# Altium project WiFi-GPRS_Combo.PrjPcb
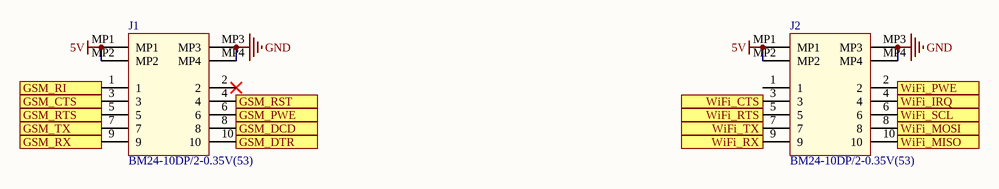
[diagram p0: Expansition.SchDoc]
4 sheets, 53 parts. Net scope: flat (ports and power ports of the same name join across sheets).
Board file: WiFi-GPRS_Combo.PcbDoc
Sheets:
  Expansition.SchDoc
  GPRS.SchDoc
  LTE.SchDoc
  SimCard.SchDoc

## Sheet Expansition.SchDoc: Expansion/Connectors
size A4; DrawnBy: Muhammet YILDIZ; Organization: YılDıZ IoT; Revision: 1.1; SheetNumber: 3; SheetTotal: 7; SheetSize: A4

### Parts
J1  BM24-10DP/2-0.35V(53)  [HIROSE BM2410DP]
J2  BM24-10DP/2-0.35V(53)  [HIROSE BM2410DP]

### Ports
GSM_CTS (in), GSM_DCD (in), GSM_DTR (out), GSM_PWE (out), GSM_RI (in), GSM_RST (out), GSM_RTS (out), GSM_RX (in), GSM_TX (out), WiFi_CTS (in), WiFi_IRQ (in), WiFi_MISO (in), WiFi_MOSI (out), WiFi_PWE (out), WiFi_RTS (out), WiFi_RX (in), WiFi_SCL (out), WiFi_TX (out)

### Nets
5V: J1.MP1 J1.MP2 J2.MP1 J2.MP2
GND: J1.MP3 J1.MP4 J2.MP3 J2.MP4
CTS: J1.3 ; port GSM_CTS
DCD: J1.8 ; port GSM_DCD
DTR: J1.10 ; port GSM_DTR
POWERKEY: J1.4 ; port GSM_RST
RING: J1.1 ; port GSM_RI
RTS: J1.5 ; port GSM_RTS
RXD: J1.7 ; port GSM_TX
TXD: J1.9 ; port GSM_RX
NetJ1_6: J1.6 ; port GSM_PWE
NetJ2_2: J2.2 ; port WiFi_PWE
NetJ2_3: J2.3 ; port WiFi_CTS
NetJ2_4: J2.4 ; port WiFi_IRQ
NetJ2_5: J2.5 ; port WiFi_RTS
NetJ2_6: J2.6 ; port WiFi_SCL
NetJ2_7: J2.7 ; port WiFi_TX
NetJ2_8: J2.8 ; port WiFi_MOSI
NetJ2_9: J2.9 ; port WiFi_RX
NetJ2_10: J2.10 ; port WiFi_MISO

Not connected (* = marked no-connect by the designer): J1 2*; J2 1

### Notes on the sheet
- Title:
- Size:
- Project:
- Revision:
- Sheet
- of
- Date:
- YıLDıZ IoT
- Elperek Mahallesi
- Saray Sokak, No:12
- SAKARYA / TURKEY
- File:

### Library data of the parts
J1 J2 = 12 Pin (10 + 2 Power) B2B Header: Board to Board Connector; Manufacturer: Hirose; Pitch: 0.014inch; Mated Stacking Heights: 0.8mm; Supplier 1: Digi-Key; Supplier Part Number 1: H124923CT-ND; Manufacturer Part Number: BM24-10DP/2-0.35V(53); Stock 1: 2583; Pricing 1: 1 = 1,08000, 10 = 0,95400, 25 = 0,89760, 50 = 0,86020, 100 = 0,82280, 250 = 0,74800, 500 = 0,67320 (USD); RoHS: Yes; Mount: Surface Mount; Number of Pins: 10; Contact Plating: Gold; Packaging: Tape and Reel; Number of Rows: 2; ComponentLink1URL: https://media.digikey.com/pdf/Data%20Sheets/Hirose%20PDFs/BM24.pdf?src-supplier=Digi-Key; ComponentLink1Description: https://media.digikey.com/pdf/Data%20Sheets/Hirose%20PDFs/BM24.pdf?src-supplier=Digi-Key; ComponentLink2URL: https://www.hirose.com/product/en/download_file/key_name/BM24-10DP__2-0.35V%2853%29/category/Specification%20Sheet/doc_file_id/87039/?file_category_id=9&item_id=06772001953&is_series=&src-supplier=Digi-Key; ComponentLink2Description: https://www.hirose.com/product/en/download_file/key_name/BM24-10DP__2-0.35V%2853%29/category/Specification%20Sheet/doc_file_id/87039/?file_category_id=9&item_id=06772001953&is_series=&src-supplier=Digi-Key

## Sheet GPRS.SchDoc: GPRS
size A4; DrawnBy: Muhammet YILDIZ; Organization: YıLDıZ IoT; Revision: 1.1; SheetNumber: 4; SheetTotal: 7; SheetSize: A4
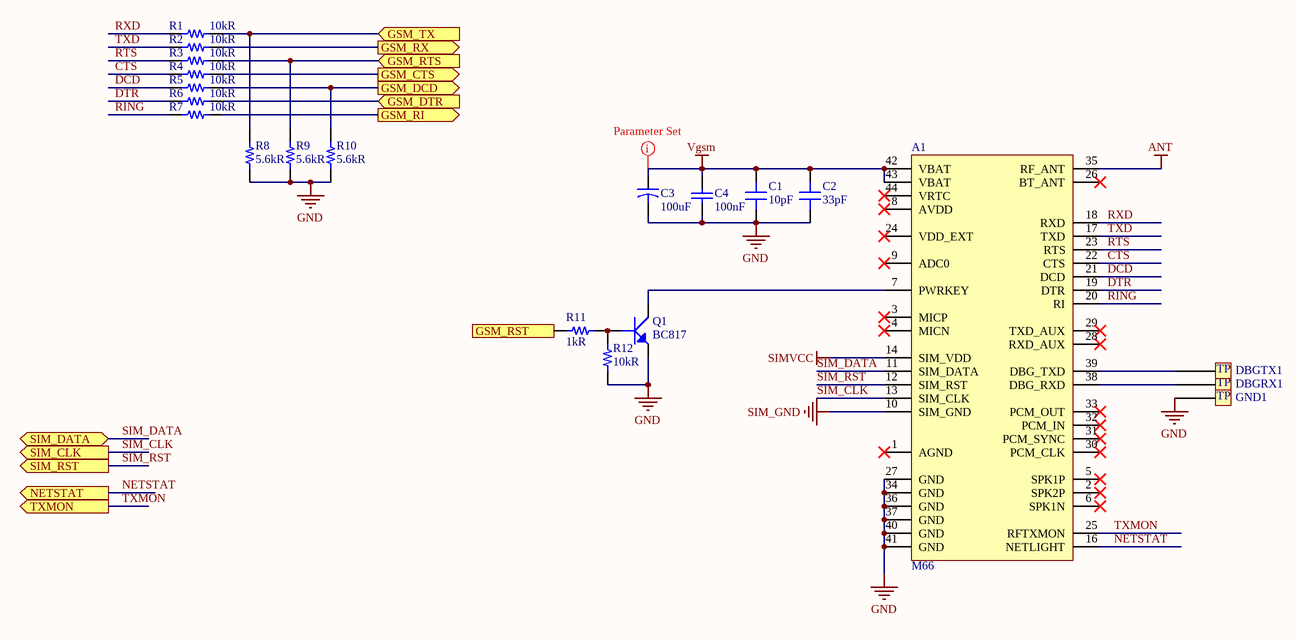
[diagram p1: GPRS.SchDoc]

### Parts
A1  M66  [QUECTEL - M66]
C1  10pF  [CAP 0603/1608]
C2  33pF  [CAP 0603/1608]
C3  100uF  [CAP POL 2012X150USR]
C4  100nF  [CAP 0603/1608]
DBGRX1  Test Point  [TestPoint]  (value not drawn)  (no BOM)
DBGTX1  Test Point  [TestPoint]  (value not drawn)  (no BOM)
GND1  Test Point  [TestPoint]  (value not drawn)  (no BOM)
Q1  BC817  [SOT23-3]
R1  10kR  [RES 0603/1608]
R2  10kR  [RES 0603/1608]
R3  10kR  [RES 0603/1608]
R4  10kR  [RES 0603/1608]
R5  10kR  [RES 0603/1608]
R6  10kR  [RES 0603/1608]
R7  10kR  [RES 0603/1608]
R8  5.6kR  [RES 0603/1608]
R9  5.6kR  [RES 0603/1608]
R10  5.6kR  [RES 0603/1608]
R11  1kR  [RES 0603/1608]
R12  10kR  [RES 0603/1608]

### Ports
GSM_CTS (out), GSM_DCD (out), GSM_DTR (in), GSM_RI (out), GSM_RST (in), GSM_RTS (in), GSM_RX (out), GSM_TX (in), NETSTAT (out), SIM_CLK (out), SIM_DATA (bidir), SIM_RST (out), TXMON (out)

### Nets
ANT: A1.35(RF_ANT)
GND: A1.27(GND) A1.34(GND) A1.36(GND) A1.37(GND) A1.40(GND) A1.41(GND) C1.1 C2.1 C3.1 C4.1 GND1.1 Q1.2(E) R8.1 R9.1 R10.1 R12.1
SIM_GND: A1.10(SIM_GND)
SIMVCC: A1.14(SIM_VDD)
Vgsm: A1.42(VBAT) A1.43(VBAT) C1.2 C2.2 C3.2 C4.2
CTS: R4.1 ; port GSM_CTS
CTS: A1.22(CTS) R4.2  [a separate net that carries the same name]
DCD: R5.1 R10.2 ; port GSM_DCD
DCD: A1.21(DCD) R5.2  [a separate net that carries the same name]
DTR: R6.1 ; port GSM_DTR
DTR: A1.19(DTR) R6.2  [a separate net that carries the same name]
NETSTAT: A1.16(NETLIGHT) ; port NETSTAT
POWERKEY: R11.2 ; port GSM_RST
RING: R7.1 ; port GSM_RI
RING: A1.20(RI) R7.2  [a separate net that carries the same name]
RTS: R3.1 R9.2 ; port GSM_RTS
RTS: A1.23(RTS) R3.2  [a separate net that carries the same name]
RXD: R1.1 R8.2 ; port GSM_TX
RXD: A1.18(RXD) R1.2  [a separate net that carries the same name]
SIM_CLK: A1.13(SIM_CLK) ; port SIM_CLK
SIM_DATA: A1.11(SIM_DATA) ; port SIM_DATA
SIM_RST: A1.12(SIM_RST) ; port SIM_RST
TXD: R2.1 ; port GSM_RX
TXD: A1.17(TXD) R2.2  [a separate net that carries the same name]
TXMON: A1.25(RFTXMON) ; port TXMON
NetA1_7: A1.7(PWRKEY) Q1.3(C)
NetA1_38: A1.38(DBG_RXD) DBGRX1.1
NetA1_39: A1.39(DBG_TXD) DBGTX1.1
NetQ1_1: Q1.1(B) R11.1 R12.2

Not connected (* = marked no-connect by the designer): A1 1(AGND)* 2(SPK2P)* 3(MICP)* 4(MICN)* 5(SPK1P)* 6(SPK1N)* 8(AVDD)* 9(ADC0)* 15(NC) 24(VDD_EXT)* 26(BT_ANT)* 28(RXD_AUX)* 29(TXD_AUX)* 30(PCM_CLK)* 31(PCM_SYNC)* 32(PCM_IN)* 33(PCM_OUT)* 44(VRTC)*

### Layout directives
rule Width Constraint [Pref Width = 0.5mm    Min Width = 0.5mm    Max Width = 3mm]; net class Vgsm: Vgsm

### Notes on the sheet
- Title:
- Size:
- Project:
- Revision:
- Sheet
- of
- Date:
- YıLDıZ IoT
- Elperek Mahallesi
- Saray Sokak, No:12
- SAKARYA / TURKEY
- File:
- (in symbol Test Point) TP

### Library data of the parts
A1 = Qectel M66: GSM/GPRS Module Series; Manufacturer: QUECTEL; RF Family/Standard: Cellular, Navigation; Protocol: 2G GPRS, GSM; Frequency: 824MHz ~ 960MHz, 1.71GHz ~ 1.99GHz; Data Rate: 85.6kbps; Power - Output: 32.2dBm; Sensitivity: -109dBm; Serial Interfaces: UART; Antenna Type: Antenna Not Included; Voltage - Supply: 3.8V; Current - Receiving: 350mA; Manufacturer Part Number: M66; Supplier 1: empa; Supplier Part Number 1: M66DSFA-04-STD; Stock 1: 1144; Pricing 1: 1 = 6,27 (USD); RoHS: No; Case/Package: Module; ComponentLink1URL: https://www.u-blox.com/sites/default/files/SARA-G3_DataSheet_%28UBX-13000993%29.pdf?src-supplier=Digi-Key; ComponentLink1Description: https://www.u-blox.com/sites/default/files/SARA-G3_DataSheet_%28UBX-13000993%29.pdf?src-supplier=Digi-Key; Current - Transmitting: 350mA; Operating Temperature: 40°C ~ 85°C
C1 = Capacitor - Ceramic: Ceramic, SMT Capacitor; Manufacturer: Yageo; Manufacturer Part Number: CC0603JRNPO9BN100; Tolerance: 5%; Voltage Rating: 50V; Dielectric: C0G; Temperature Coefficient: 30ppm/°C; Insulation Resistance: 100GR; Supplier 1: Digi-Key; Supplier Part Number 1: 311-1058-1-ND; Stock 1: 128799; Pricing 1: 1 = 0,10000, 10 = 0,06100, 100 = 0,02730, 500 = 0,01948, 1000 = 0,01530 (USD); RoHS: Yes; Mount: Surface Mount; Case/Package: 0603; Number of Pins: 2; Case Code (Metric): 1608; Case Code (Imperial): 0603; Min Operating Temperature: -55°C; Max Operating Temperature: 125°C; Capacitance: 10pF; Voltage Rating (DC): 50V; Packaging: Tape and Reel; Package Quantity: 1; Termination: SMD/SMT; Composition: Ceramic; Voltage: 50V; Length: 1.6mm; Height: 0.8mm; Width: 0.031inch; Thickness: 0.035inch; Depth: 0.8mm; Radiation Hardening: No; REACH SVHC: No SVHC; Lead Free: Lead Free; ComponentLink1URL: http://www.farnell.com/datasheets/2213336.pdf?src-supplier=Farnell; ComponentLink1Description: http://www.farnell.com/datasheets/2213336.pdf?src-supplier=Farnell; ComponentLink2URL: https://www.verical.com/server-webapp/html/getDatasheet?partID=403524&src-supplier=Verical; ComponentLink2Description: https://www.verical.com/server-webapp/html/getDatasheet?partID=403524&src-supplier=Verical; ComponentLink3URL: http://www.farnell.com/datasheets/1835847.pdf?src-supplier=Element14; ComponentLink3Description: http://www.farnell.com/datasheets/1835847.pdf?src-supplier=Element14; ComponentLink4URL: http://www.yageo.com/documents/recent/UPY-GP_NP0_16V-to-50V_16.pdf?src-supplier=Digi-Key; ComponentLink4Description: http://www.yageo.com/documents/recent/UPY-GP_NP0_16V-to-50V_16.pdf?src-supplier=Digi-Key; ComponentLink5URL: http://www.farnell.com/datasheets/1734582.pdf?src-supplier=Element14; ComponentLink5Description: http://www.farnell.com/datasheets/1734582.pdf?src-supplier=Element14; ComponentLink6URL: http://www.yageo.com/documents/recent/UPY-GP_NP0_16V-to-50V_8.pdf?src-supplier=Avnet+Europe; ComponentLink6Description: http://www.yageo.com/documents/recent/UPY-GP_NP0_16V-to-50V_8.pdf?src-supplier=Avnet+Europe; ComponentLink7URL: http://www.mouser.com/ds/2/447/Yageo_UPY-GP_NP0_16V-to-50V_9-358835.pdf?src-supplier=Mouser; ComponentLink7Description: http://www.mouser.com/ds/2/447/Yageo_UPY-GP_NP0_16V-to-50V_9-358835.pdf?src-supplier=Mouser; ComponentLink8URL: http://www.farnell.com/datasheets/1132289.pdf?src-supplier=Element14; ComponentLink8Description: http://www.farnell.com/datasheets/1132289.pdf?src-supplier=Element14
C2 = Capacitor - Ceramic: Ceramic, SMT Capacitor; Manufacturer: Walsin Technologies; Manufacturer Part Number: 0603N330J500CT; Tolerance: 5%; Dielectric: C0G; Voltage Rating: 50V; Supplier 1: Digi-Key; Supplier Part Number 1: 1292-1645-1-ND; Stock 1: 411190; Pricing 1: 1 = 0,10000, 10 = 0,03300, 100 = 0,01490, 500 = 0,01062, 1000 = 0,00835 (USD); RoHS: Yes; Case/Package: Ceramic; Case Code (Metric): 1608; Case Code (Imperial): 0603; Min Operating Temperature: -55°C; Max Operating Temperature: 125°C; Capacitance: 33pF; Packaging: Tape and Reel; Voltage Rating (DC): 50V; Length: 1.6mm; Depth: 0.8mm; Radiation Hardening: No; REACH SVHC: Unknown; Lead Free: Lead Free; ComponentLink1URL: https://www.verical.com/server-webapp/html/getDatasheet?partID=572322&src-supplier=Verical; ComponentLink1Description: https://www.verical.com/server-webapp/html/getDatasheet?partID=572322&src-supplier=Verical
C3 = Capacitor - Tantalum: Capacitor, Tantalum; Manufacturer: Kyocera AVX; Manufacturer Part Number: TPSB107M006R0250; ESR (Equivalent Series Resistance): 250mR; Voltage Rating: 6.3V; Tolerance: 20%; Polarity: Polar; Dissipation Factor: 10%; Supplier 1: Digi-Key; Supplier Part Number 1: 478-4978-1-ND; Stock 1: 22431; Pricing 1: 1 = 0,65000, 10 = 0,47900, 100 = 0,32840, 500 = 0,25996, 1000 = 0,21891 (USD); RoHS: Yes; Mount: Surface Mount; Case/Package: 1210; Number of Pins: 2; Case Code (Imperial): 1210; Case Code (Metric): 3528; Dielectric Material: Tantalum; Min Operating Temperature: -55°C; Max Operating Temperature: 125°C; Capacitance: 100uF; Package Quantity: 1; Packaging: Tape and Reel; Termination: SMD/SMT; Voltage Rating (DC): 6.3V; Features: General Purpose; Length: 3.5mm; Height: 2.1mm; Width: 2.8mm; Height - Seated (Max): 0.083inch; Depth: 2.8mm; Radiation Hardening: No; Lead Free: Lead Free; ComponentLink1URL: http://datasheets.avx.com/TPS.pdf?src-supplier=Digi-Key; ComponentLink1Description: http://datasheets.avx.com/TPS.pdf?src-supplier=Digi-Key; ComponentLink2URL: http://www.avx.com/docs/catalogs/tps.pdf?src-supplier=Avnet; ComponentLink2Description: http://www.avx.com/docs/catalogs/tps.pdf?src-supplier=Avnet; ComponentLink3URL: http://www.avxcorp.com/docs/Catalogs/tps.pdf?src-supplier=Future+Electronics; ComponentLink3Description: http://www.avxcorp.com/docs/Catalogs/tps.pdf?src-supplier=Future+Electronics; ComponentLink4URL: http://www.avx.com/docs/catalogs/tps.pdf?src-supplier=Avnet+Europe; ComponentLink4Description: http://www.avx.com/docs/catalogs/tps.pdf?src-supplier=Avnet+Europe
C4 = Cap - Ceramic: Capacitor, Ceramic; Manufacturer: Samsung; Manufacturer Part Number: CL10A104KA8NNNC; Tolerance: 10%; Voltage Rating: 25V; Dielectric: X5R; Supplier 1: Digi-Key; Supplier Part Number 1: 1276-1857-1-ND; Stock 1: 978306; Pricing 1: 1 = 0,10000, 10 = 0,04600, 100 = 0,02070, 500 = 0,01478, 1000 = 0,01162 (USD); RoHS: Yes; Mount: Surface Mount; Case/Package: 0603; Case Code (Metric): 1608; Case Code (Imperial): 0603; Contact Plating: Tin; Min Operating Temperature: -55°C; Max Operating Temperature: 85°C; Package Quantity: 1; Packaging: Tape and Reel; Capacitance: 100nF; Voltage Rating (DC): 25V; Termination: Wraparound; Length: 0.063inch; Width: 0.031inch; Thickness: 0.035inch; Lead Free: Lead Free; ComponentLink1URL: http://www.samsungsem.com/kr/support/library/product-catalog/mlcc.jsp; ComponentLink1Description: http://www.samsungsem.com/kr/support/library/product-catalog/mlcc.jsp; Price: 0,1
DBGRX1 DBGTX1 GND1 = Test Point: Custom Test Point
Q1 = BC817: Transistor, BC817; Manufacturer: ON Semiconductor; Manufacturer Part Number: BC817-16LT1G; Transistor Type: NPN; Vce Saturation (Max) @ Ib, Ic: 700mV @ 50mA, 500mA; Current - Collector Cutoff (Max): 100nA (ICBO); DC Current Gain (hFE) (Min) @ Ic, Vce: 100 @ 100mA, 1V; Frequency - Transition: 100MHz; Supplier 1: Digi-Key; Supplier Part Number 1: BC817-16LT1GOSCT-ND; RoHS: RoHS Compliant; Category: Discrete Semiconductor Products; Stock 1: 46603; Pricing 1: 1=0.13, 10=0.118, 100=0.0642, 500=0.0395, 1000=0.02693 (USD); Packaging: Cut Tape (CT); Part Status: Active; Operating Temperature: -65°C ~ 150°C (TJ); Mounting Type: Surface Mount; Package / Case: TO-236-3, SC-59, SOT-23-3; Supplier Device Package: SOT-23-3 (TO-236); Base Part Number: BC817; ComponentLink1URL: http://www.onsemi.com/pub/Collateral/BC817-16LT1-D.PDF; ComponentLink1Description: http://www.onsemi.com/pub/Collateral/BC817-16LT1-D.PDF; Price: 0,13
R1-R7 R12 = Resistor_Chip: Ceramic, SMT Capacitor; Manufacturer: Stackpole Electronics; Manufacturer Part Number: RNCP0603FTD10K0; Tolerance: 1%; Max Power Dissipation: 125mW; Temperature Coefficient: 100ppm/°C; Supplier 1: Digi-Key; Supplier Part Number 1: RNCP0603FTD10K0CT-ND; Stock 1: 183083; Pricing 1: 1 = 0,10000, 10 = 0,06700, 100 = 0,02730, 1000 = 0,01224, 2500 = 0,01063 (USD); RoHS: Yes; Mount: Surface Mount; Case/Package: 0603; Case Code (Metric): 1608; Case Code (Imperial): 0603; Contact Plating: Matte,Tin; Min Operating Temperature: -55°C; Max Operating Temperature: 155°C; Packaging: Tape and Reel; Resistance: 10kR; Composition: Thin Film; Number of Terminations: 2; Features: Anti-Sulfur,Moisture Resistant; Length: 0.059inch; Height: 0.02inch; Width: 0.031inch; Radiation Hardening: No; Lead Free: Lead Free
R8-R10 = Resistor_Chip: Ceramic, SMT Capacitor; Manufacturer: TE Connectivity; Manufacturer Part Number: CRGCQ0603F5K6; Tolerance: 1%; Max Power Dissipation: 100mW; Temperature Coefficient: 100ppm/°C; Supplier 1: Digi-Key; Supplier Part Number 1: A129697CT-ND; Stock 1: 37798; Pricing 1: 1 = 0,10000, 10 = 0,03000, 100 = 0,01200, 1000 = 0,00541, 2500 = 0,00469 (USD); RoHS: No; Case/Package: 0603; Case Code (Imperial): 0603; Case Code (Metric): 1608; Min Operating Temperature: -55°C; Max Operating Temperature: 155°C; Composition: Thick Film; Features: Moisture Resistant,Automotive AEC-Q200; Packaging: Cut Tape; Resistance: 5.6kR; Number of Terminations: 2; ComponentLink1URL: http://www.farnell.com/datasheets/2609223.pdf?src-supplier=Farnell; ComponentLink1Description: http://www.farnell.com/datasheets/2609223.pdf?src-supplier=Farnell; ComponentLink2URL: https://www.te.com/commerce/DocumentDelivery/DDEController?Action=srchrtrv&amp;DocNm=1773204-3&amp;DocType=DS&amp;DocLang=English&src-supplier=Digi-Key; ComponentLink2Description: https://www.te.com/commerce/DocumentDelivery/DDEController?Action=srchrtrv&amp;DocNm=1773204-3&amp;DocType=DS&amp;DocLang=English&src-supplier=Digi-Key; ComponentLink3URL: https://www.te.com/commerce/DocumentDelivery/DDEController?Action=srchrtrv&DocNm=1773204-3&DocType=DS&DocLang=English&src-supplier=Digi-Key; ComponentLink3Description: https://www.te.com/commerce/DocumentDelivery/DDEController?Action=srchrtrv&DocNm=1773204-3&DocType=DS&DocLang=English&src-supplier=Digi-Key
R11 = Resistor_Chip: Ceramic, SMT Capacitor; Manufacturer: Rohm; Manufacturer Part Number: ESR03EZPJ102; Tolerance: 5%; Temperature Coefficient: 200ppm/°C; Max Power Dissipation: 250mW; Supplier 1: Digi-Key; Supplier Part Number 1: RHM1.0KDCT-ND; Stock 1: 148117; Pricing 1: 1 = 0,10000, 10 = 0,08300, 100 = 0,03180, 1000 = 0,01398, 2500 = 0,01207 (USD); RoHS: Yes; Case/Package: 0603; Case Code (Metric): 1608; Case Code (Imperial): 0603; Min Operating Temperature: -55°C; Max Operating Temperature: 155°C; Resistance: 1kR; Package Quantity: 1; Packaging: Tape and Reel; Composition: Thick Film; Number of Terminations: 2; Features: Automotive AEC-Q200; Length: 0.063inch; Height: 0.022inch; Width: 0.031inch; Lead Free: Lead Free; ComponentLink1URL: https://datasheet.ciiva.com/2469/esr-2469603.pdf?src-supplier=Digi-Key; ComponentLink1Description: https://datasheet.ciiva.com/2469/esr-2469603.pdf?src-supplier=Digi-Key; ComponentLink2URL: https://datasheet.ciiva.com/2469/esr-2469604.pdf?src-supplier=Digi-Key; ComponentLink2Description: https://datasheet.ciiva.com/2469/esr-2469604.pdf?src-supplier=Digi-Key; ComponentLink3URL: https://datasheet.ciiva.com/2469/esr-2469605.pdf?src-supplier=Digi-Key; ComponentLink3Description: https://datasheet.ciiva.com/2469/esr-2469605.pdf?src-supplier=Digi-Key

## Sheet LTE.SchDoc: LTE
size A4; DrawnBy: Muhammet YILDIZ; Organization: YıLDıZ IoT; Revision: 1.1; SheetNumber: 6; SheetTotal: 7; SheetSize: A4
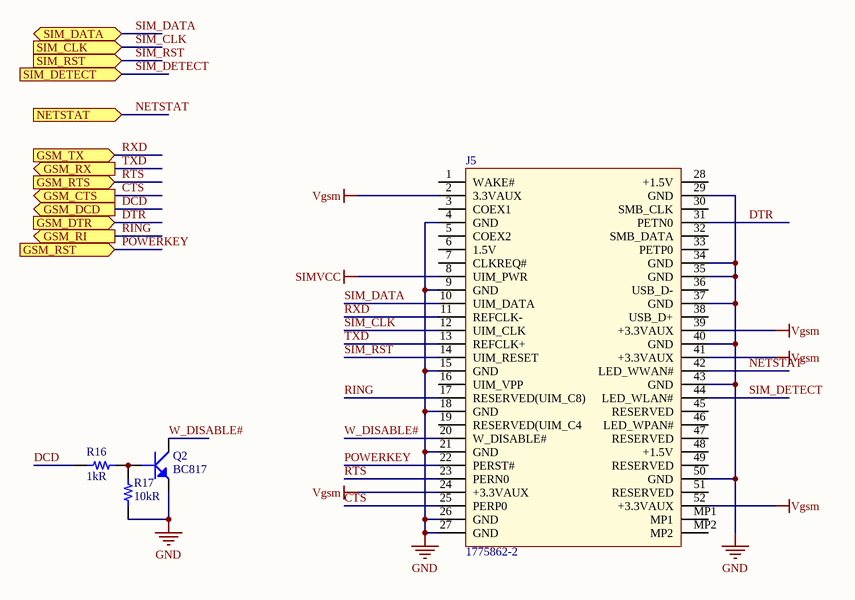
[diagram p2: LTE.SchDoc]

### Parts
J5  1775862-2  [TE 1775862-2]
Q2  BC817  [SOT23-3]
R16  1kR  [RES 0603/1608]
R17  10kR  [RES 0603/1608]

### Ports
GSM_CTS (out), GSM_DCD (out), GSM_DTR (in), GSM_RI (out), GSM_RST (in), GSM_RTS (in), GSM_RX (out), GSM_TX (in), NETSTAT (in), SIM_CLK (in), SIM_DATA (bidir), SIM_DETECT (in), SIM_RST (in)

### Nets
GND: J5.4(GND) J5.9(GND) J5.15(GND) J5.18(GND) J5.21(GND) J5.26(GND) J5.27(GND) J5.29(GND) J5.34(GND) J5.35(GND) J5.37(GND) J5.40(GND) J5.43(GND) J5.50(GND) Q2.2(E) R17.1
SIMVCC: J5.8(UIM_PWR)
Vgsm: J5.2(3.3VAUX) J5.24(+3.3VAUX) J5.39(+3.3VAUX) J5.41(+3.3VAUX) J5.52(+3.3VAUX)
CTS: J5.25(PERP0) ; port GSM_CTS
DCD: R16.2 ; port GSM_DCD
DTR: J5.31(PETN0) ; port GSM_DTR
NETSTAT: J5.42(LED_WWAN#) ; port NETSTAT
POWERKEY: J5.22(PERST#) ; port GSM_RST
RING: J5.17(RESERVED(UIM_C8)) ; port GSM_RI
RTS: J5.23(PERN0) ; port GSM_RTS
RXD: J5.11(REFCLK-) ; port GSM_TX
SIM_CLK: J5.12(UIM_CLK) ; port SIM_CLK
SIM_DATA: J5.10(UIM_DATA) ; port SIM_DATA
SIM_DETECT: J5.44(LED_WLAN#) ; port SIM_DETECT
SIM_RST: J5.14(UIM_RESET) ; port SIM_RST
TXD: J5.13(REFCLK+) ; port GSM_RX
W_DISABLE#: J5.20(W_DISABLE#) Q2.3(C)
NetQ2_1: Q2.1(B) R16.1 R17.2

Not connected (* = marked no-connect by the designer): J5 1(WAKE#) 3(COEX1) 5(COEX2) 6(1.5V) 7(CLKREQ#) 16(UIM_VPP) 19(RESERVED(UIM_C4) 28(+1.5V) 30(SMB_CLK) 32(SMB_DATA) 33(PETP0) 36(USB_D-) 38(USB_D+) 45(RESERVED) 46(LED_WPAN#) 47(RESERVED) 48(+1.5V) 49(RESERVED) 51(RESERVED) MP1 MP2

### Notes on the sheet
- Title:
- Size:
- Project:
- Revision:
- Sheet
- of
- Date:
- YıLDıZ IoT
- Elperek Mahallesi
- Saray Sokak, No:12
- SAKARYA / TURKEY
- File:

### Library data of the parts
J5 = Mini PCIe: Manufacturer: TE Connectivity; Number of Contacts: 52; Connector Type: Receptacle; High Temperature Housing: Yes; PCB Mount Retention: Without; PCB Mounting Orientation: Horizontal; Stackable: No; Pitch: 0.8mm; Row Spacing: 0.031inch; Stack Height: 5.2mm; Supplier 1: Digi-Key; Supplier Part Number 1: A142273CT-ND; Manufacturer Part Number: 1775862-2; Stock 1: 11289; Pricing 1: 1 = 0,77000, 10 = 0,72000, 25 = 0,64840, 50 = 0,57620, 100 = 0,55230, 250 = 0,50424 (USD); RoHS: Yes; Mount: Surface Mount; Contact Plating: Gold; Contact Material: Copper Alloy; Housing Material: Thermoplastic; Housing Color: Black; Termination: Solder; Number of Rows: 2; Packaging: Tape and Reel; Orientation: Right Angle; Number of Positions: 52; Package Quantity: 550; Radiation Hardening: No; Flammability Rating: UL94 V-0; Lead Free: Contains Lead; ELV: Compliant; ComponentLink1URL: http://www.farnell.com/datasheets/2645681.pdf?src-supplier=Farnell; ComponentLink1Description: http://www.farnell.com/datasheets/2645681.pdf?src-supplier=Farnell; ComponentLink2URL: http://components.arrow.com/part/dataview/0323_06583025?src-supplier=Arrow+Europe; ComponentLink2Description: http://components.arrow.com/part/dataview/0323_06583025?src-supplier=Arrow+Europe; ComponentLink3URL: http://www.onlinecomponents.com/datasheet/17758622.aspx?p=10266609&src-supplier=Onlinecomponents.com; ComponentLink3Description: http://www.onlinecomponents.com/datasheet/17758622.aspx?p=10266609&src-supplier=Onlinecomponents.com; ComponentLink4URL: http://components.arrow.com/part/dataview/47764795S8999339N5665?src-supplier=Arrow+Electronics; ComponentLink4Description: http://components.arrow.com/part/dataview/47764795S8999339N5665?src-supplier=Arrow+Electronics; ComponentLink5URL: https://www.te.com/commerce/DocumentDelivery/DDEController?Action=srchrtrv&DocNm=1775862&DocType=Customer+Drawing&DocLang=English&src-supplier=Digi-Key; ComponentLink5Description: https://www.te.com/commerce/DocumentDelivery/DDEController?Action=srchrtrv&DocNm=1775862&DocType=Customer+Drawing&DocLang=English&src-supplier=Digi-Key; ComponentLink6URL: http://www.farnell.com/datasheets/2645681.pdf?src-supplier=Element14; ComponentLink6Description: http://www.farnell.com/datasheets/2645681.pdf?src-supplier=Element14; ComponentLink7URL: https://www.te.com/commerce/DocumentDelivery/DDEController?Action=srchrtrv&amp;DocNm=1775862&amp;DocType=Customer+Drawing&amp;DocLang=English&src-supplier=Digi-Key; ComponentLink7Description: https://www.te.com/commerce/DocumentDelivery/DDEController?Action=srchrtrv&amp;DocNm=1775862&amp;DocType=Customer+Drawing&amp;DocLang=English&src-supplier=Digi-Key; ComponentLink8URL: http://www.farnell.com/datasheets/2645681.pdf?src-supplier=Newark; ComponentLink8Description: http://www.farnell.com/datasheets/2645681.pdf?src-supplier=Newark; ComponentLink9URL: http://www.te.com/commerce/DocumentDelivery/DDEController?Action=showdoc&DocId=Data+Sheet8-1773459-7_EXPRESS_MINI_CARD_QRG1011pdfEnglishENG_DS_8-1773459-7_EXPRESS_MINI_CARD_QRG_1011.pdf&src-supplier=Avnet; ComponentLink9Description: http://www.te.com/commerce/DocumentDelivery/DDEController?Action=showdoc&DocId=Data+Sheet8-1773459-7_EXPRESS_MINI_CARD_QRG1011pdfEnglishENG_DS_8-1773459-7_EXPRESS_MINI_CARD_QRG_1011.pdf&src-supplier=Avnet; ComponentLink10URL: http://www.te.com/commerce/DocumentDelivery/DDEController?Action=showdoc&DocId=Data+Sheet%7F8-1773459-7_EXPRESS_MINI_CARD_QRG%7F1011%7Fpdf%7FEnglish%7FENG_DS_8-1773459-7_EXPRESS_MINI_CARD_QRG_1011.pdf&src-supplier=Avnet+Europe; ComponentLink10Description: http://www.te.com/commerce/DocumentDelivery/DDEController?Action=showdoc&DocId=Data+Sheet%7F8-1773459-7_EXPRESS_MINI_CARD_QRG%7F1011%7Fpdf%7FEnglish%7FENG_DS_8-1773459-7_EXPRESS_MINI_CARD_QRG_1011.pdf&src-supplier=Avnet+Europe; ComponentLink11URL: http://www.te.com/commerce/DocumentDelivery/DDEController?Action=showdoc&DocId=Data+Sheet8-1773459-7_EXPRESS_MINI_CARD_QRG1011pdfEnglishENG_DS_8-1773459-7_EXPRESS_MINI_CARD_QRG_1011.pdf&src-supplier=Avnet+Asia; ComponentLink11Description: http://www.te.com/commerce/DocumentDelivery/DDEController?Action=showdoc&DocId=Data+Sheet8-1773459-7_EXPRESS_MINI_CARD_QRG1011pdfEnglishENG_DS_8-1773459-7_EXPRESS_MINI_CARD_QRG_1011.pdf&src-supplier=Avnet+Asia
Q2 = BC817: as Q1 on sheet GPRS; Supplier 1: Digi-Key; Supplier Part Number 1: BC817-16LT1GOSCT-ND; RoHS: RoHS Compliant; Category: Discrete Semiconductor Products; Stock 1: 46603; Pricing 1: 1=0.13, 10=0.118, 100=0.0642, 500=0.0395, 1000=0.02693 (USD); Packaging: Cut Tape (CT); Part Status: Active; Operating Temperature: -65°C ~ 150°C (TJ); Mounting Type: Surface Mount; Package / Case: TO-236-3, SC-59, SOT-23-3; Supplier Device Package: SOT-23-3 (TO-236); Base Part Number: BC817; ComponentLink1URL: http://www.onsemi.com/pub/Collateral/BC817-16LT1-D.PDF; ComponentLink1Description: http://www.onsemi.com/pub/Collateral/BC817-16LT1-D.PDF; Price: 0,13
R16 = Resistor_Chip: as R11 on sheet GPRS; Supplier 1: Digi-Key; Supplier Part Number 1: RHM1.0KDCT-ND; Stock 1: 148117; Pricing 1: 1 = 0,10000, 10 = 0,08300, 100 = 0,03180, 1000 = 0,01398, 2500 = 0,01207 (USD); RoHS: Yes; Case/Package: 0603; Case Code (Metric): 1608; Case Code (Imperial): 0603; Min Operating Temperature: -55°C; Max Operating Temperature: 155°C; Resistance: 1kR; Package Quantity: 1; Packaging: Tape and Reel; Composition: Thick Film; Number of Terminations: 2; Features: Automotive AEC-Q200; Length: 0.063inch; Height: 0.022inch; Width: 0.031inch; Lead Free: Lead Free; ComponentLink1URL: https://datasheet.ciiva.com/2469/esr-2469603.pdf?src-supplier=Digi-Key; ComponentLink1Description: https://datasheet.ciiva.com/2469/esr-2469603.pdf?src-supplier=Digi-Key; ComponentLink2URL: https://datasheet.ciiva.com/2469/esr-2469604.pdf?src-supplier=Digi-Key; ComponentLink2Description: https://datasheet.ciiva.com/2469/esr-2469604.pdf?src-supplier=Digi-Key; ComponentLink3URL: https://datasheet.ciiva.com/2469/esr-2469605.pdf?src-supplier=Digi-Key; ComponentLink3Description: https://datasheet.ciiva.com/2469/esr-2469605.pdf?src-supplier=Digi-Key
R17 = Resistor_Chip: as R1 on sheet GPRS; Supplier 1: Digi-Key; Supplier Part Number 1: RNCP0603FTD10K0CT-ND; Stock 1: 183083; Pricing 1: 1 = 0,10000, 10 = 0,06700, 100 = 0,02730, 1000 = 0,01224, 2500 = 0,01063 (USD); RoHS: Yes; Mount: Surface Mount; Case/Package: 0603; Case Code (Metric): 1608; Case Code (Imperial): 0603; Contact Plating: Matte,Tin; Min Operating Temperature: -55°C; Max Operating Temperature: 155°C; Packaging: Tape and Reel; Resistance: 10kR; Composition: Thin Film; Number of Terminations: 2; Features: Anti-Sulfur,Moisture Resistant; Length: 0.059inch; Height: 0.02inch; Width: 0.031inch; Radiation Hardening: No; Lead Free: Lead Free

## Sheet SimCard.SchDoc: Sim Card
size A4; DrawnBy: Muhammet YILDIZ; Organization: YıLDıZ IoT; Revision: 1.1; SheetNumber: 7; SheetTotal: 7; SheetSize: A4
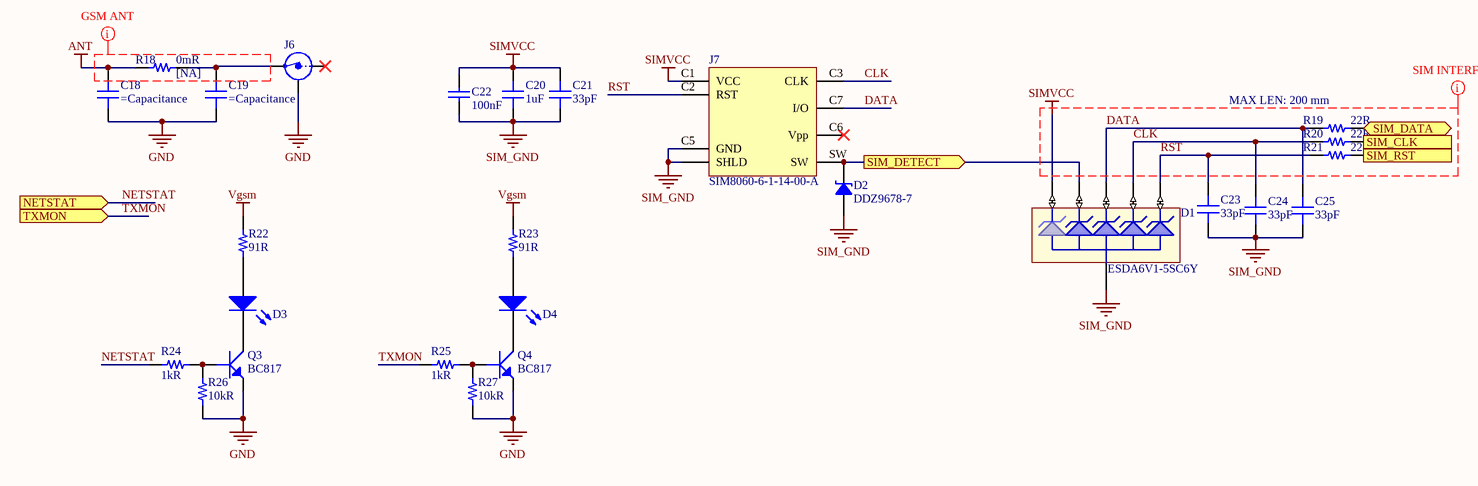
[diagram p3: SimCard.SchDoc]

### Parts
C18  (no value)  [CAP 0603/1608]  (no BOM)
C19  (no value)  [CAP 0603/1608]  (no BOM)
C20  1uF  [CAP 0603/1608]
C21  33pF  [CAP 0603/1608]
C22  100nF  [CAP 0603/1608]
C23  33pF  [CAP 0603/1608]
C24  33pF  [CAP 0603/1608]
C25  33pF  [CAP 0603/1608]
D1  ESDA6V1-5SC6Y  [SOT23-6]
D2  DDZ9678-7  [SOD-123]
D3  150080VS75000  [LED-0805-A]  (value not drawn)  (no BOM)
D4  150080VS75000  [LED-0805-A]  (value not drawn)  (no BOM)
J6  1909763-1  [TE C-1909763]  (value not drawn)
J7  SIM8060-6-1-14-00-A  [GCT SIM8060-6-1-14-00-A]
Q3  BC817  [SOT23-3]  (no BOM)
Q4  BC817  [SOT23-3]  (no BOM)
R18  0mR  [RES 0603/1608]  (no BOM)
R19  22R  [RES 0603/1608]
R20  22R  [RES 0603/1608]
R21  22R  [RES 0603/1608]
R22  91R  [RES 0603/1608]  (no BOM)
R23  91R  [RES 0603/1608]  (no BOM)
R24  1kR  [RES 0603/1608]
R25  1kR  [RES 0603/1608]
R26  10kR  [RES 0603/1608]
R27  10kR  [RES 0603/1608]

### Ports
NETSTAT (in), SIM_CLK (in), SIM_DATA (bidir), SIM_DETECT (out), SIM_RST (in), TXMON (in)

### Nets
ANT: C18.2 R18.1
GND: C18.1 C19.1 J6.G(Shield) Q3.2(E) Q4.2(E) R26.1 R27.1
SIM_GND: C20.1 C21.1 C22.1 C23.1 C24.1 C25.1 D1.2 D2.1 J7.C5(GND) J7.S(SHLD)
SIMVCC: C20.2 C21.2 C22.2 D1.1 J7.C1(VCC)
Vgsm: R22.2 R23.2
CLK: C24.2 D1.5 J7.C3(CLK) R20.1
DATA: C25.2 D1.4 J7.C7(I/O) R19.1
NETSTAT: R24.2 ; port NETSTAT
RST: C23.2 D1.6 J7.C2(RST) R21.1
SIM_CLK: R20.2 ; port SIM_CLK
SIM_DATA: R19.2 ; port SIM_DATA
SIM_DETECT: D1.3 D2.2 J7.SW ; port SIM_DETECT
SIM_RST: R21.2 ; port SIM_RST
TXMON: R25.2 ; port TXMON
NetC19_2: C19.2 J6.S(IN) R18.2
NetD3_A: D3.A R22.1
NetD3_K: D3.K Q3.3(C)
NetD4_A: D4.A R23.1
NetD4_K: D4.K Q4.3(C)
NetQ3_1: Q3.1(B) R24.1 R26.2
NetQ4_1: Q4.1(B) R25.1 R27.2

Not connected (* = marked no-connect by the designer): J7 C6(Vpp)*

### Layout directives
net class SIM CARD: CLK, DATA, RST, SIMVCC
net class GSM ANT: (no net found under the mark)

### Notes on the sheet
- MAX LEN: 200 mm
- Title:
- Size:
- Project:
- Revision:
- Sheet
- of
- Date:
- YıLDıZ IoT
- Elperek Mahallesi
- Saray Sokak, No:12
- SAKARYA / TURKEY
- File:

### Library data of the parts
C18 C19 = Capacitor - Ceramic: Ceramic, SMT Capacitor
C20 = Capacitor - Ceramic: Ceramic, SMT Capacitor; Manufacturer: Samsung; Manufacturer Part Number: CL10A105KP8NNNC; Tolerance: 10%; Voltage Rating: 10V; Dielectric: X5R; Supplier 1: Digi-Key; Supplier Part Number 1: 1276-1182-1-ND; Stock 1: 4590831; Pricing 1: 1 = 0,10000, 10 = 0,03800, 100 = 0,01680, 500 = 0,01200, 1000 = 0,00943 (USD); RoHS: Yes; Mount: Surface Mount; Case/Package: 0603; Case Code (Metric): 1608; Case Code (Imperial): 0603; Contact Plating: Tin; Min Operating Temperature: -55°C; Max Operating Temperature: 85°C; Packaging: Tape and Reel; Package Quantity: 1; Capacitance: 1uF; Voltage: 10V; Length: 1.6mm; Height: 0.8mm; Width: 0.031inch; Thickness: 0.035inch; Depth: 0.8mm; Radiation Hardening: No; ComponentLink1URL: https://datasheet.ciiva.com/15195/getdatasheetpartid-358616-15195708.pdf?src-supplier=Verical; ComponentLink1Description: https://datasheet.ciiva.com/15195/getdatasheetpartid-358616-15195708.pdf?src-supplier=Verical; ComponentLink2URL: https://datasheet.ciiva.com/16358/cl05b104kq5nnnc-16358431.pdf?src-supplier=Future+Electronics; ComponentLink2Description: https://datasheet.ciiva.com/16358/cl05b104kq5nnnc-16358431.pdf?src-supplier=Future+Electronics
C21 C23-C25 = Capacitor - Ceramic: as C2 on sheet GPRS; Supplier 1: Digi-Key; Supplier Part Number 1: 1292-1645-1-ND; Stock 1: 411190; Pricing 1: 1 = 0,10000, 10 = 0,03300, 100 = 0,01490, 500 = 0,01062, 1000 = 0,00835 (USD); RoHS: Yes; Case/Package: Ceramic; Case Code (Metric): 1608; Case Code (Imperial): 0603; Min Operating Temperature: -55°C; Max Operating Temperature: 125°C; Capacitance: 33pF; Packaging: Tape and Reel; Voltage Rating (DC): 50V; Length: 1.6mm; Depth: 0.8mm; Radiation Hardening: No; REACH SVHC: Unknown; Lead Free: Lead Free; ComponentLink1URL: https://www.verical.com/server-webapp/html/getDatasheet?partID=572322&src-supplier=Verical; ComponentLink1Description: https://www.verical.com/server-webapp/html/getDatasheet?partID=572322&src-supplier=Verical
C22 = Cap - Ceramic: as C4 on sheet GPRS; Supplier 1: Digi-Key; Supplier Part Number 1: 1276-1857-1-ND; Stock 1: 978306; Pricing 1: 1 = 0,10000, 10 = 0,04600, 100 = 0,02070, 500 = 0,01478, 1000 = 0,01162 (USD); RoHS: Yes; Mount: Surface Mount; Case/Package: 0603; Case Code (Metric): 1608; Case Code (Imperial): 0603; Contact Plating: Tin; Min Operating Temperature: -55°C; Max Operating Temperature: 85°C; Package Quantity: 1; Packaging: Tape and Reel; Capacitance: 100nF; Voltage Rating (DC): 25V; Termination: Wraparound; Length: 0.063inch; Width: 0.031inch; Thickness: 0.035inch; Lead Free: Lead Free; ComponentLink1URL: http://www.samsungsem.com/kr/support/library/product-catalog/mlcc.jsp; ComponentLink1Description: http://www.samsungsem.com/kr/support/library/product-catalog/mlcc.jsp; Price: 0,1
D1 = TVS Array 5 ch: Dual-line Transil™,  transient voltage suppressor (TVS); Manufacturer: STMicroelectronics; Type: Zener; Voltage - Reverse Standoff (Typ): 5.2V; Voltage - Breakdown (Min): 6.1V; Voltage - Clamping (Max) @ Ipp: 11.4V; Current - Peak Pulse (10/1000µs): 7A (8/20µs); Power - Peak Pulse: 80W; Power Line Protection: No; Supplier 1: Digi-Key; RoHS: RoHS Compliant; Category: Circuit Protection; Stock 1: 55; Pricing 1: 1=0.37, 10=0.3, 100=0.2042, 500=0.15314, 1000=0.11486 (USD); Packaging: Cut Tape (CT); Part Status: Active; Applications: General Purpose; Capacitance @ Frequency: -; Operating Temperature: -40°C ~ 150°C (TJ); Mounting Type: Surface Mount; Package / Case: SOT-23-6; Supplier Device Package: SOT-23-6; ComponentLink1URL: http://www.st.com/content/ccc/resource/technical/document/datasheet/group3/cf/58/f6/44/dc/90/4f/72/DM00342426/files/DM00342426.pdf/jcr:content/translations/en.DM00342426.pdf; ComponentLink1Description: http://www.st.com/content/ccc/resource/technical/document/datasheet/group3/cf/58/f6/44/dc/90/4f/72/DM00342426/files/DM00342426.pdf/jcr:content/translations/en.DM00342426.pdf; Supplier Part Number 1: 497-17311-1-ND; Manufacturer Part Number: ESDA6V1-5SC6Y
D2 = DDZ9678-7: DIODE ZENER 1.8V 500MW SOD123; Manufacturer: Diodes Incorporated; Current - Reverse Leakage @ Vr: 7.5µA @ 1V; Tolerance: ±5%; Voltage - Forward (Vf) (Max) @ If: 900mV @ 10mA; Part Number: DDZ9678-7; ComponentLink1Description: Datasheet; ComponentLink1URL: https://www.diodes.com/assets/Datasheets/ds30410.pdf; ComponentLink2Description: DigiKey Link; ComponentLink2URL: http://digikey.com/product-detail/en/diodes-incorporated/DDZ9678-7/DDZ9678DICT-ND/1964750; LastUpdated: 02.09.2020 01:19:27; Lifecycle Status: Active; Minimum Order: 1; Mounting Type: Surface Mount; Operating Temperature: -65°C ~ 150°C; Package / Case: SOD-123; Packaging: TapeAndReel; PartId: 1698; Part Status: Active; Power - Max: 500mW; Price: 0.06; Series: -; Supplier 1: DigiKey; Supplier Part Number 1: DDZ9678DICT-ND; Supplier Device Package: SOD-123; Voltage - Zener (Nom) (Vz): 1.8V
D3 D4 = LED: Smd Led; Manufacturer: Wurth Electronics; Color: Green; Luminous Intensity: 40mcd; Forward Current: 30mA; Forward Voltage: 2V; Viewing Angle: 140°; Wavelength: 570nm; Lens Style: Clear,Rectangular; Test Current: 20mA; Supplier 1: Digi-Key; Supplier Part Number 1: 732-4986-1-ND; Manufacturer Part Number: 150080VS75000; Stock 1: 73352; Pricing 1: 1 = 0,17000, 50 = 0,16000, 100 = 0,13700, 500 = 0,11800 (USD); RoHS: Yes; Mount: Surface Mount; Case/Package: 0805; Case Code (Metric): 2012; Case Code (Imperial): 0805; Min Operating Temperature: -40°C; Max Operating Temperature: 85°C; Package Quantity: 4000; Packaging: Tape and Reel; Dominant Wavelength: 570nm; Length: 2mm; Height: 0.7mm; Width: 1.25mm; REACH SVHC: Unknown; ComponentLink1URL: http://www.farnell.com/datasheets/1911352.pdf?src-supplier=Element14; ComponentLink1Description: http://www.farnell.com/datasheets/1911352.pdf?src-supplier=Element14; ComponentLink2URL: https://katalog.we-online.de/led/datasheet/150080VS75000.pdf?src-supplier=Digi-Key; ComponentLink2Description: https://katalog.we-online.de/led/datasheet/150080VS75000.pdf?src-supplier=Digi-Key; ComponentLink3URL: http://www.produktinfo.conrad.com/datenblaetter/750000-774999/759437-da-01-en-CHIPLED_0805_W_KL_H_GRUEN_150080VS7500.pdf?src-supplier=Conrad; ComponentLink3Description: http://www.produktinfo.conrad.com/datenblaetter/750000-774999/759437-da-01-en-CHIPLED_0805_W_KL_H_GRUEN_150080VS7500.pdf?src-supplier=Conrad
J6 = RF Connector - UFL: Coaxial Connector with Switch; Manufacturer: TE Connectivity AMP; Body Material: Polymer,Liquid Crystal Polymer; Body Plating: Gold; Dielectric Material: Polymer; Connector System: Cable-to-Board; Number of Positions: 1; Frequency: 6GHz; Sealable: No (Without); Gender: Female; Impedance: 50R; Connector Type: Jack; Supplier 1: Digi-Key; Supplier Part Number 1: A118077CT-ND; Manufacturer Part Number: 1909763-1; Stock 1: 72730; Pricing 1: 1 = 0,50000, 10 = 0,47200, 100 = 0,36150, 500 = 0,31436, 1000 = 0,25935 (USD); RoHS: Yes; Mount: Panel; Case/Package: SMD/SMT; Contact Plating: Gold; Contact Material: Copper Alloy; Housing Color: Beige; Insulation Material: Thermoplastic; Min Operating Temperature: -40°C; Max Operating Temperature: 194°C; Max Frequency: 6GHz; Termination: SMD/SMT; Packaging: Tape and Reel; Package Quantity: 1; Fastening Type: Push,Pull; Orientation: Straight; Length: 3mm; Radiation Hardening: No; ELV: Compliant; Lead Free: Lead Free; ComponentLink1URL: https://datasheet.ciiva.com/16312/eng-cd-1909763-b-16312469.pdf?src-supplier=Future+Electronics; ComponentLink1Description: https://datasheet.ciiva.com/16312/eng-cd-1909763-b-16312469.pdf?src-supplier=Future+Electronics; ComponentLink2URL: https://datasheet.ciiva.com/16469/eng-cd-1909763-b-16469221.pdf?src-supplier=Avnet+Asia; ComponentLink2Description: https://datasheet.ciiva.com/16469/eng-cd-1909763-b-16469221.pdf?src-supplier=Avnet+Asia; ComponentLink3URL: https://datasheet.ciiva.com/9423/eng-cd-1909763-b-9423785.pdf?src-supplier=Avnet; ComponentLink3Description: https://datasheet.ciiva.com/9423/eng-cd-1909763-b-9423785.pdf?src-supplier=Avnet; ComponentLink4URL: https://datasheet.ciiva.com/29191/eng-cd-1909763-b1-basefilename-29191146.pdf?src-supplier=Digi-Key; ComponentLink4Description: https://datasheet.ciiva.com/29191/eng-cd-1909763-b1-basefilename-29191146.pdf?src-supplier=Digi-Key; ComponentLink5URL: https://datasheet.ciiva.com/29191/eng-cd-1909763-b1-basefilename-29191148.pdf?src-supplier=Digi-Key; ComponentLink5Description: https://datasheet.ciiva.com/29191/eng-cd-1909763-b1-basefilename-29191148.pdf?src-supplier=Digi-Key
J7 = SIM8060-6-1-14-00-A: CONN SIM NANO HINGED 6P W/SWITCH; Manufacturer: Global Connector Technology; ComponentLink1Description: Datasheet; ComponentLink1URL: https://gct.co/files/drawings/sim8060.pdf; ComponentLink2Description: DigiKey Link; ComponentLink2URL: http://digikey.com/product-detail/en/gct/SIM8060-6-1-14-00-A/2073-SIM8060-6-1-14-00-ACT-ND/10127236; Supplier 1: Digi-Key; Supplier Part Number 1: 2073-SIM8060-6-1-14-00-ACT-ND; Manufacturer Part Number: SIM8060-6-1-14-00-A; Stock 1: 0; RoHS: No
Q3 Q4 = BC817: as Q1 on sheet GPRS; Supplier 1: Digi-Key; Supplier Part Number 1: BC817-16LT1GOSCT-ND; RoHS: RoHS Compliant; Category: Discrete Semiconductor Products; Stock 1: 46603; Pricing 1: 1=0.13, 10=0.118, 100=0.0642, 500=0.0395, 1000=0.02693 (USD); Packaging: Cut Tape (CT); Part Status: Active; Operating Temperature: -65°C ~ 150°C (TJ); Mounting Type: Surface Mount; Package / Case: TO-236-3, SC-59, SOT-23-3; Supplier Device Package: SOT-23-3 (TO-236); Base Part Number: BC817; ComponentLink1URL: http://www.onsemi.com/pub/Collateral/BC817-16LT1-D.PDF; ComponentLink1Description: http://www.onsemi.com/pub/Collateral/BC817-16LT1-D.PDF; Price: 0,13
R18 = Resistor_Chip: Ceramic, SMT Capacitor; Manufacturer: Stackpole Electronics; Manufacturer Part Number: RMCF0603ZT0R00; Power Rating: 100mW; Current Rating: 1A; Working Voltage: 75V; Supplier 1: Digi-Key; Supplier Part Number 1: RMCF0603ZT0R00CT-ND; Stock 1: 2712388; Pricing 1: 1 = 0,10000, 10 = 0,01600, 25 = 0,01160, 50 = 0,00880, 100 = 0,00640, 250 = 0,00492, 500 = 0,00392, 1000 = 0,00289 (USD); RoHS: Yes; Mount: Surface Mount; Case/Package: 0603; Case Code (Metric): 1608; Case Code (Imperial): 0603; Contact Plating: Matte,Tin; Min Operating Temperature: -55°C; Max Operating Temperature: 155°C; Resistance: 0mR; Packaging: Tape and Reel; Composition: Thick Film; Number of Terminations: 2; Military Standard: Not; Max Power Dissipation: 100mW; Features: Automotive AEC-Q200; Length: 1.55mm; Height: 0.022inch; Width: 0.031inch; Depth: 0.8mm; Radiation Hardening: No; Lead Free: Lead Free; [NA]: [NA]
R19-R21 = Resistor_Chip: Ceramic, SMT Capacitor; Manufacturer: Yageo; Manufacturer Part Number: RC0603FR-0722RL; Tolerance: 1%; Voltage Rating (DC): 50V; Temperature Coefficient: 100ppm/°C; Power Rating: 100mW; Supplier 1: Digi-Key; Supplier Part Number 1: 311-22.0HRCT-ND; Stock 1: 4572399; Pricing 1: 1 = 0,10000, 10 = 0,02400, 100 = 0,00970, 1000 = 0,00437, 2500 = 0,00379 (USD); RoHS: Yes; Case/Package: 0603; Number of Pins: 2; Case Code (Metric): 1608; Case Code (Imperial): 0603; Min Operating Temperature: -55°C; Max Operating Temperature: 155°C; Resistance: 22R; Packaging: Tape and Reel; Composition: Thick Film; Voltage Rating: 50V; Package Quantity: 1; Number of Terminations: 2; Termination: SMD/SMT; Military Standard: Not; Max Power Dissipation: 100mW; Features: Moisture Resistant; Length: 1.6mm; Height: 0.022inch; Width: 0.031inch; Depth: 0.8mm; REACH SVHC: No SVHC; Lead Free: Lead Free; ComponentLink1URL: http://www.yageo.com/documents/recent/PYu-RC_Group_51_RoHS_L_10.pdf?src-supplier=Digi-Key; ComponentLink1Description: http://www.yageo.com/documents/recent/PYu-RC_Group_51_RoHS_L_10.pdf?src-supplier=Digi-Key; ComponentLink2URL: http://documents.rs-components.com/techlib://itc_doclist_GB.htm?stockno=5050369&src-supplier=RSComponents; ComponentLink2Description: http://documents.rs-components.com/techlib://itc_doclist_GB.htm?stockno=5050369&src-supplier=RSComponents; ComponentLink3URL: http://www.farnell.com/datasheets/1868787.pdf?src-supplier=Element14; ComponentLink3Description: http://www.farnell.com/datasheets/1868787.pdf?src-supplier=Element14; ComponentLink4URL: http://www.farnell.com/datasheets/443971.pdf?src-supplier=Element14; ComponentLink4Description: http://www.farnell.com/datasheets/443971.pdf?src-supplier=Element14
R22 R23 = Resistor_Chip: Ceramic, SMT Capacitor; Manufacturer: Yageo; Manufacturer Part Number: RC0603JR-0791RL; Tolerance: 5%; Voltage Rating (DC): 50V; Temperature Coefficient: 100ppm/°C; Power Rating: 100mW; Voltage Rating: 75V; Supplier 1: Digi-Key; Supplier Part Number 1: 311-91GRCT-ND; Stock 1: 320507; Pricing 1: 1 = 0,10000, 10 = 0,02000, 100 = 0,00810, 1000 = 0,00362, 2500 = 0,00314 (USD); RoHS: Yes; Case/Package: 0603; Weight: 7.1E-05oz; Case Code (Imperial): 0603; Case Code (Metric): 1608; Min Operating Temperature: -55°C; Max Operating Temperature: 155°C; Resistance: 91R; Packaging: Tape and Reel; Composition: Thick Film; Military Standard: Not; Termination: SMD/SMT; Working Voltage: 75V; Number of Terminations: 2; Length: 1.6mm; Height: 0.45mm; Depth: 0.8mm; Width: 0.8mm; Lead Free: Lead Free
R24 R25 = Resistor_Chip: as R11 on sheet GPRS; Supplier 1: Digi-Key; Supplier Part Number 1: RHM1.0KDCT-ND; Stock 1: 148117; Pricing 1: 1 = 0,10000, 10 = 0,08300, 100 = 0,03180, 1000 = 0,01398, 2500 = 0,01207 (USD); RoHS: Yes; Case/Package: 0603; Case Code (Metric): 1608; Case Code (Imperial): 0603; Min Operating Temperature: -55°C; Max Operating Temperature: 155°C; Resistance: 1kR; Package Quantity: 1; Packaging: Tape and Reel; Composition: Thick Film; Number of Terminations: 2; Features: Automotive AEC-Q200; Length: 0.063inch; Height: 0.022inch; Width: 0.031inch; Lead Free: Lead Free; ComponentLink1URL: https://datasheet.ciiva.com/2469/esr-2469603.pdf?src-supplier=Digi-Key; ComponentLink1Description: https://datasheet.ciiva.com/2469/esr-2469603.pdf?src-supplier=Digi-Key; ComponentLink2URL: https://datasheet.ciiva.com/2469/esr-2469604.pdf?src-supplier=Digi-Key; ComponentLink2Description: https://datasheet.ciiva.com/2469/esr-2469604.pdf?src-supplier=Digi-Key; ComponentLink3URL: https://datasheet.ciiva.com/2469/esr-2469605.pdf?src-supplier=Digi-Key; ComponentLink3Description: https://datasheet.ciiva.com/2469/esr-2469605.pdf?src-supplier=Digi-Key
R26 R27 = Resistor_Chip: as R1 on sheet GPRS; Supplier 1: Digi-Key; Supplier Part Number 1: RNCP0603FTD10K0CT-ND; Stock 1: 183083; Pricing 1: 1 = 0,10000, 10 = 0,06700, 100 = 0,02730, 1000 = 0,01224, 2500 = 0,01063 (USD); RoHS: Yes; Mount: Surface Mount; Case/Package: 0603; Case Code (Metric): 1608; Case Code (Imperial): 0603; Contact Plating: Matte,Tin; Min Operating Temperature: -55°C; Max Operating Temperature: 155°C; Packaging: Tape and Reel; Resistance: 10kR; Composition: Thin Film; Number of Terminations: 2; Features: Anti-Sulfur,Moisture Resistant; Length: 0.059inch; Height: 0.02inch; Width: 0.031inch; Radiation Hardening: No; Lead Free: Lead Free

## Nets that join several sheets
ANT: GPRS (A1.35), SimCard (C18.2 R18.1)
GND: Expansition (J1.MP3 J1.MP4 J2.MP3 J2.MP4), GPRS (16 pins), LTE (16 pins), SimCard (7 pins)
SIM_GND: GPRS (A1.10), SimCard (10 pins)
SIMVCC: GPRS (A1.14), LTE (J5.8), SimCard (5 pins)
Vgsm: GPRS (6 pins), LTE (5 pins), SimCard (R22.2 R23.2)
CTS: Expansition (J1.3), GPRS (R4.1), LTE (J5.25)
DCD: Expansition (J1.8), GPRS (R5.1 R10.2), LTE (R16.2)
DTR: Expansition (J1.10), GPRS (R6.1), LTE (J5.31)
NETSTAT: GPRS (A1.16), LTE (J5.42), SimCard (R24.2)
POWERKEY: Expansition (J1.4), GPRS (R11.2), LTE (J5.22)
RING: Expansition (J1.1), GPRS (R7.1), LTE (J5.17)
RTS: Expansition (J1.5), GPRS (R3.1 R9.2), LTE (J5.23)
RXD: Expansition (J1.7), GPRS (R1.1 R8.2), LTE (J5.11)
SIM_CLK: GPRS (A1.13), LTE (J5.12), SimCard (R20.2)
SIM_DATA: GPRS (A1.11), LTE (J5.10), SimCard (R19.2)
SIM_DETECT: LTE (J5.44), SimCard (D1.3 D2.2 J7.SW)
SIM_RST: GPRS (A1.12), LTE (J5.14), SimCard (R21.2)
TXD: Expansition (J1.9), GPRS (R2.1), LTE (J5.13)
TXMON: GPRS (A1.25), SimCard (R25.2)